# EAGLE design CurrentMonitor (EAGLE 6.4)

## Sheet 1 of 2
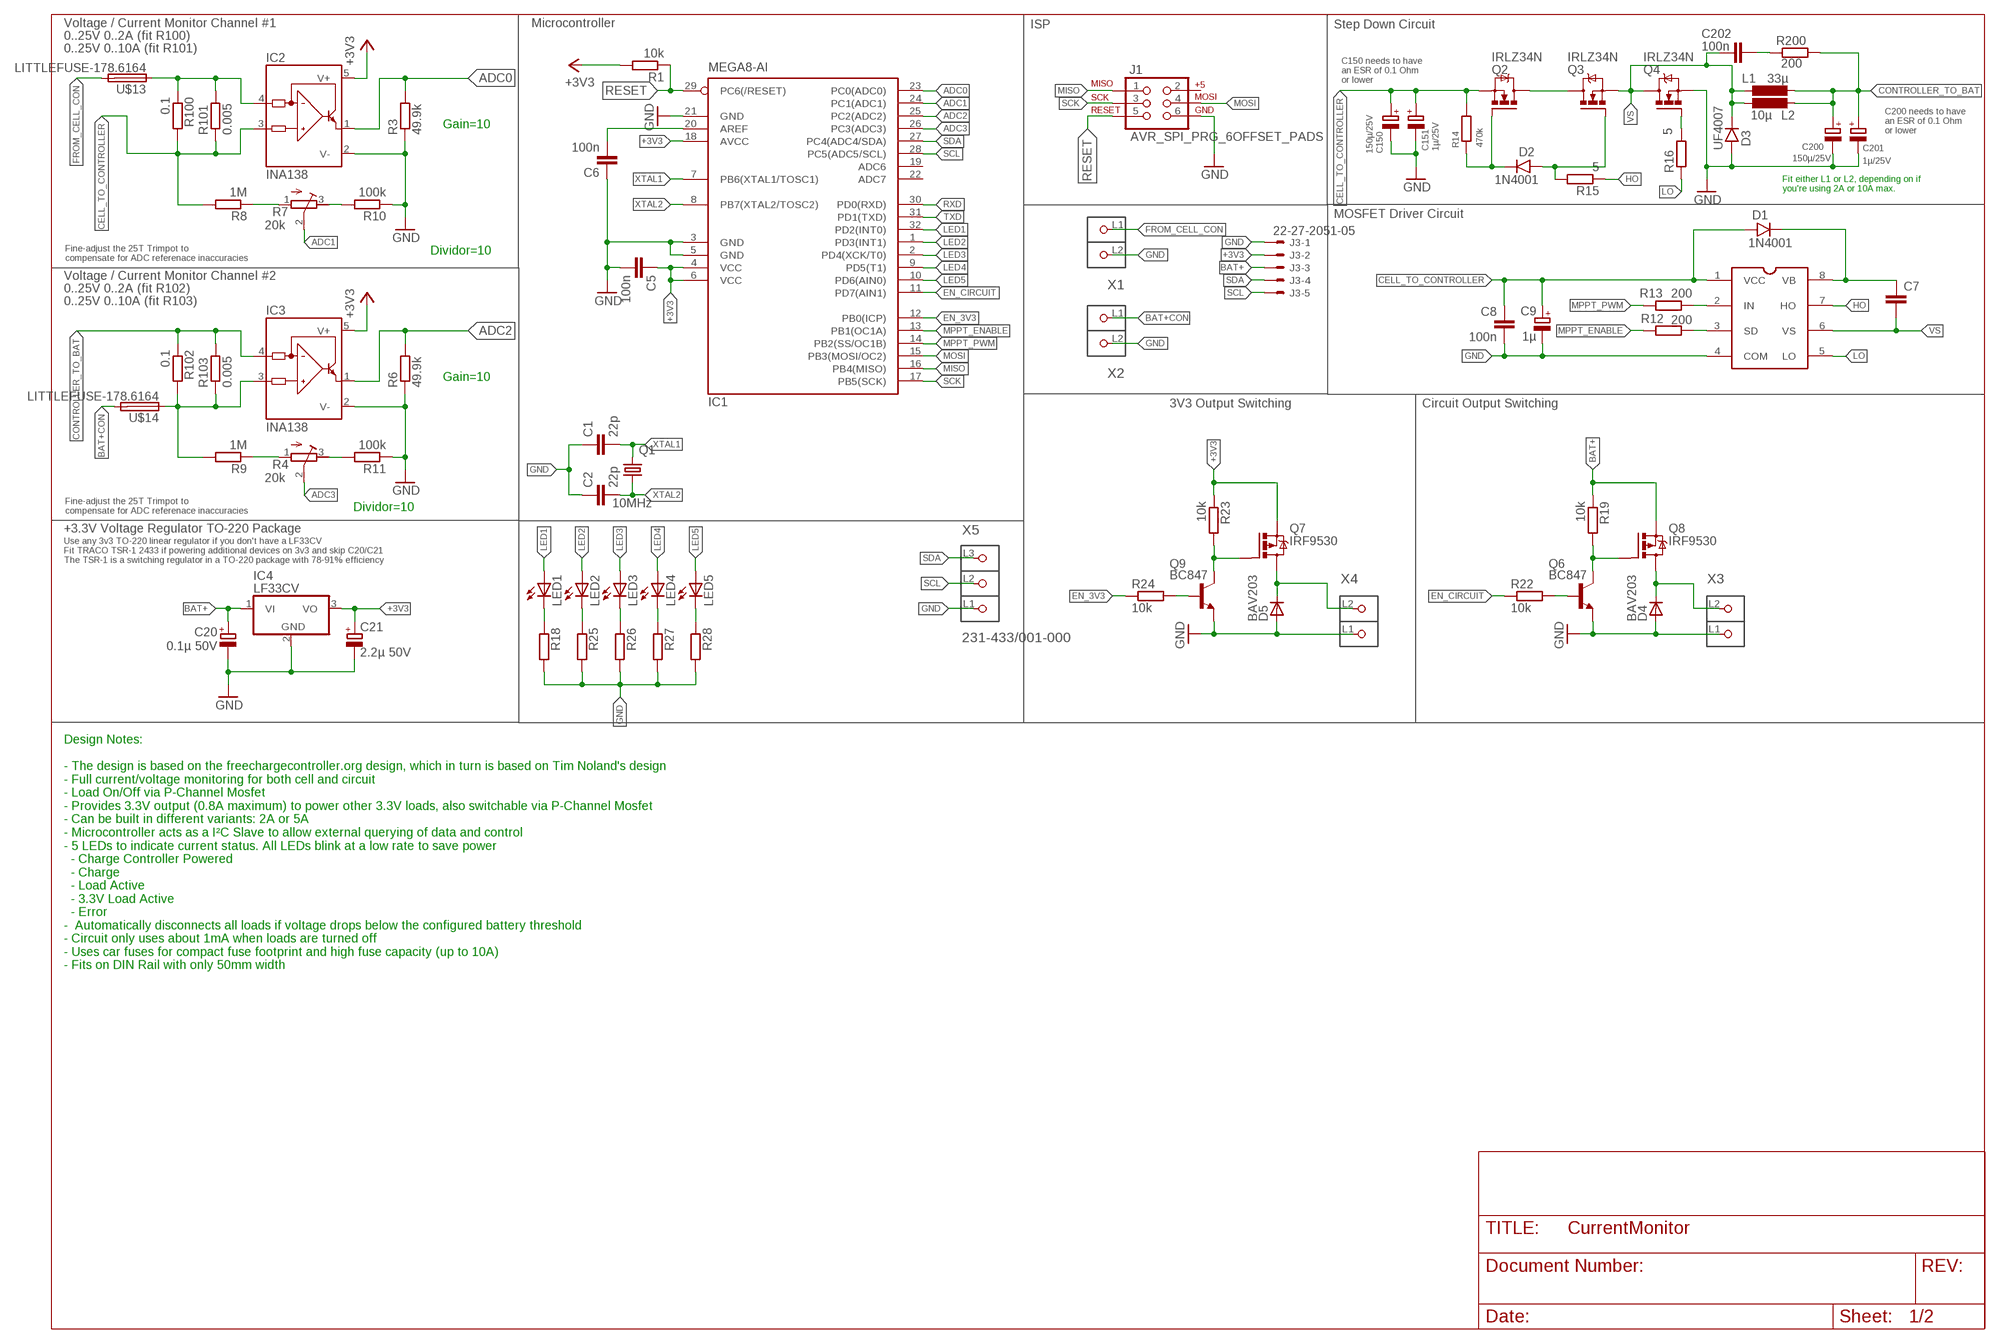
[diagram p0: schematic, sheet 1]

### Parts
C1  22p  C-EUC1206  [C1206]
C2  22p  C-EUC1206  [C1206]
C5  100n  C-EUC0805  [C0805]
C6  100n  C-EUC0805  [C0805]
C7  C-EUC0805  [C0805]
C8  100n  C-EUC0805  [C0805]
C9  1µ  CPOL-EUA  [PANASONIC_A]
C20  0.1µ 50V  CPOL-EUA  [PANASONIC_A]
C21  2.2µ 50V  CPOL-EUB  [PANASONIC_B]
C150  150µ/25V  CPOL-EUF  [PANASONIC_F]
C151  1µ/25V  CPOL-EUB  [PANASONIC_B]
C200  150µ/25V  CPOL-EUF  [PANASONIC_F]
C201  1µ/25V  CPOL-EUB  [PANASONIC_B]
C202  100n  C-EUC0805  [C0805]
D1  1N4001  DO41.3  [DO41-3]
D2  1N4001  DO41.3  [DO41-3]
D3  UF4007  DO41.3  [DO41-3]
D4  BAV203  D-SOD-80  [SOD80]
D5  BAV203  D-SOD-80  [SOD80]
IC1  MEGA8-AI  [TQFP32-08]
IC2  INA138  [SOT23-5]
IC3  INA138  [SOT23-5]
IC4  LF33CV  7805TV  [TO220V]
J1  AVR_SPI_PRG_6OFFSET_PADS  [2X3_OFFSET]
J3  22-27-2051-05  [6410-05]
L1  33µ  L-EUPISM  [PISM]
L2  10µ  L-EUPISR  [PISR]
LED1  LEDCHIPLED_1206  [CHIPLED_1206]
LED2  LEDCHIPLED_1206  [CHIPLED_1206]
LED3  LEDCHIPLED_1206  [CHIPLED_1206]
LED4  LEDCHIPLED_1206  [CHIPLED_1206]
LED5  LEDCHIPLED_1206  [CHIPLED_1206]
Q1  10MHz  CRYSTALCTS406  [CTS406]
Q2  IRLZ34N  IRF520  [TO220BV]
Q3  IRLZ34N  IRF520  [TO220BV]
Q4  IRLZ34N  IRF520  [TO220BV]
Q6  BC847  BC847ALT1SMD  [SOT23]
Q7  IRF9530  [TO220BV]
Q8  IRF9530  [TO220BV]
Q9  BC847  BC847ALT1SMD  [SOT23]
R1  10k  R-EU_R0805  [R0805]
R3  49.9k  R-EU_R0805  [R0805]
R4  20k  R-TRIMM64W  [RTRIM64W]
R6  49.9k  R-EU_R0805  [R0805]
R7  20k  R-TRIMM64W  [RTRIM64W]
R8  1M  R-EU_R0805  [R0805]
R9  1M  R-EU_R0805  [R0805]
R10  100k  R-EU_R0805  [R0805]
R11  100k  R-EU_R0805  [R0805]
R12  200  R-EU_R0805  [R0805]
R13  200  R-EU_R0805  [R0805]
R14  470k  R-EU_R0805  [R0805]
R15  5  R-EU_R0805  [R0805]
R16  5  R-EU_R0805  [R0805]
R18  R-EU_R0805  [R0805]
R19  10k  R-EU_R0805  [R0805]
R22  10k  R-EU_R0805  [R0805]
R23  10k  R-EU_R0805  [R0805]
R24  10k  R-EU_R0805  [R0805]
R25  R-EU_R0805  [R0805]
R26  R-EU_R0805  [R0805]
R27  R-EU_R0805  [R0805]
R28  R-EU_R0805  [R0805]
R100  0.1  R-EU_R1206  [R1206]
R101  0.005  R-EU_R2512  [R2512]
R102  0.1  R-EU_R1206  [R1206]
R103  0.005  R-EU_R2512  [R2512]
R200  200  R-EU_R0805  [R0805]
U$1  IR2104S  [IR2104S]
U$13  LITTLEFUSE-178.6164  [LITTLEFUSE-178-6164]
U$14  LITTLEFUSE-178.6164  [LITTLEFUSE-178-6164]
X1  231-432/001-000  [P-231-432/001-000]
X2  231-432/001-000  [P-231-432/001-000]
X3  231-432/001-000  [P-231-432/001-000]
X4  231-432/001-000  [P-231-432/001-000]
X5  231-433/001-000  [P-231-433/001-000]

### Nets
+3V3 [medpower]: C5.1 C21.+ IC1.4(VCC) IC1.6(VCC) IC1.18(AVCC) IC2.5(V+) IC3.5(V+) IC4.3(VO) J3.2 Q7.S R1.2 R23.1
ADC0: IC1.23(PC0(ADC0)) IC2.1(OUT) R3.2
ADC1: IC1.24(PC1(ADC1)) R7.2(S)
ADC2: IC1.25(PC2(ADC2)) IC3.1(OUT) R6.2
ADC3: IC1.26(PC3(ADC3)) R4.2(S)
BAT+ [highpower]: C20.+ IC3.3(IN+) IC4.1(VI) J3.3 Q8.S R9.2 R19.1 R102.2 R103.1 U$14.P$1
BAT+CON [highpower]: U$14.P$2 X2.L1(P1)
CELL_TO_CONTROLLER [highpower]: C8.1 C9.+ C150.+ C151.+ D1.A IC2.3(IN+) Q2.S R8.2 R14.2 R100.2 R101.1 U$1.1(VCC)
CONTROLLER_TO_BAT [highpower]: C200.+ C201.+ IC3.4(IN-) L1.2 L2.1 R102.1 R103.2 R200.2
EN_3V3: IC1.12(PB0(ICP)) R24.1
EN_CIRCUIT: IC1.11(PD7(AIN1)) R22.1
FROM_CELL [highpower]: IC2.4(IN-) R100.1 R101.2 U$13.P$1
FROM_CELL_CON [highpower]: U$13.P$2 X1.L1(P1)
GND: C1.1 C2.1 C5.2 C6.1 C8.2 C9.- C20.- C21.- C150.- C151.- C200.- C201.- D3.A D4.2(A) D5.2(A) IC1.3(GND) IC1.5(GND) IC1.21(GND) IC2.2(V-) IC3.2(V-) IC4.2(GND) J1.6 J3.1 Q4.S Q6.2(E) Q9.2(E) R3.1 R6.1 R10.1 R11.1 R18.2 R25.2 R26.2 R27.2 R28.2 U$1.4(COM) X1.L2(P2) X2.L2(P2) X3.L1(P1) X4.L1(P1) X5.L1(P1)
HO: R15.1 U$1.7(HO)
LED1: IC1.32(PD2(INT0)) LED1.A
LED2: IC1.1(PD3(INT1)) LED2.A
LED3: IC1.2(PD4(XCK/T0)) LED3.A
LED4: IC1.9(PD5(T1)) LED4.A
LED5: IC1.10(PD6(AIN0)) LED5.A
LO: R16.1 U$1.5(LO)
MISO: IC1.16(PB4(MISO)) J1.1
MOSI: IC1.15(PB3(MOSI/OC2)) J1.4
MPPT_ENABLE: IC1.13(PB1(OC1A)) R12.1
MPPT_PWM: IC1.14(PB2(SS/OC1B)) R13.1
N$1: C6.2 IC1.20(AREF)
N$2: R4.3(E) R11.2
N$3: R7.3(E) R10.2
N$4: R7.1(A) R8.1
N$5: R4.1(A) R9.1
N$6: LED1.C R18.1
N$8: R12.2 U$1.3(SD)
N$9: C7.1 D1.C U$1.8(VB)
N$10: R13.2 U$1.2(IN)
N$11: Q4.G R16.2
N$12: D2.C Q2.G R14.1
N$13: D2.A Q3.G R15.2
N$14 [highpower]: Q2.D Q3.D
N$16: D4.1(C) Q8.D X3.L2(P2)
N$17: C202.1 R200.1
N$18: LED2.C R25.1
N$20: Q6.3(C) Q8.G R19.2
N$21: Q6.1(B) R22.2
N$22 [medpower]: Q7.G Q9.3(C) R23.2
N$23: Q9.1(B) R24.2
N$25 [medpower]: D5.1(C) Q7.D X4.L2(P2)
N$26: LED3.C R26.1
N$29: LED4.C R27.1
N$32: LED5.C R28.1
RESET: IC1.29(PC6(/RESET)) J1.5 R1.1
RXD: IC1.30(PD0(RXD))
SCK: IC1.17(PB5(SCK)) J1.3
SCL: IC1.28(PC5(ADC5/SCL)) J3.5 X5.L2(P2)
SDA: IC1.27(PC4(ADC4/SDA)) J3.4 X5.L3(P3)
TXD: IC1.31(PD1(TXD))
VS [highpower]: C7.2 C202.2 D3.C L1.1 L2.2 Q3.S Q4.D U$1.6(VS)
XTAL1: C1.2 IC1.7(PB6(XTAL1/TOSC1)) Q1.3
XTAL2: C2.2 IC1.8(PB7(XTAL2/TOSC2)) Q1.1
Unconnected: IC1.19(ADC6) IC1.22(ADC7) J1.2

### Notes on the sheet
- Voltage / Current Monitor Channel #1 | Microcontroller | ISP | Step Down Circuit
- 0..25V 0..2A (fit R100)
- 0..25V 0..10A (fit R101)
- C150 needs to have
  an ESR of 0.1 Ohm
  or lower
- Gain=10
- C200 needs to have
  an ESR of 0.1 Ohm
  or lower
- Fit either L1 or L2, depending on if
  you're using 2A or 10A max.
- MOSFET Driver Circuit
- Dividor=10
- Fine-adjust the 25T Trimpot to
  compensate for ADC referenace inaccuracies
- Voltage / Current Monitor Channel #2
- 0..25V 0..2A (fit R102)
- 0..25V 0..10A (fit R103)
- Gain=10
- 3V3 Output Switching | Circuit Output Switching
- Dividor=10
- Fine-adjust the 25T Trimpot to
  compensate for ADC referenace inaccuracies
- +3.3V Voltage Regulator TO-220 Package
- Use any 3v3 TO-220 linear regulator if you don't have a LF33CV
  Fit TRACO TSR-1 2433 if powering additional devices on 3v3 and skip C20/C21
  The TSR-1 is a switching regulator in a TO-220 package with 78-91% efficiency
- Design Notes:
  
  - The design is based on the freechargecontroller.org design, which in turn is based on Tim Noland's design
  - Full current/voltage monitoring for both cell and circuit
  - Load On/Off via P-Channel Mosfet
  - Provides 3.3V output (0.8A maximum) to power other 3.3V loads, also switchable via P-Channel Mosfet
  - Can be built in different variants: 2A or 5A
  - Microcontroller acts as a I²C Slave to allow external querying of data and control
  - 5 LEDs to indicate current status. All LEDs blink at a low rate to save power
    - Charge Controller Powered
    - Charge
    - Load Active
    - 3.3V Load Active
    - Error
  -  Automatically disconnects all loads if voltage drops below the configured battery threshold
  - Circuit only uses about 1mA when loads are turned off
  - Uses car fuses for compact fuse footprint and high fuse capacity (up to 10A)
  - Fits on DIN Rail with only 50mm width

## Sheet 2 of 2
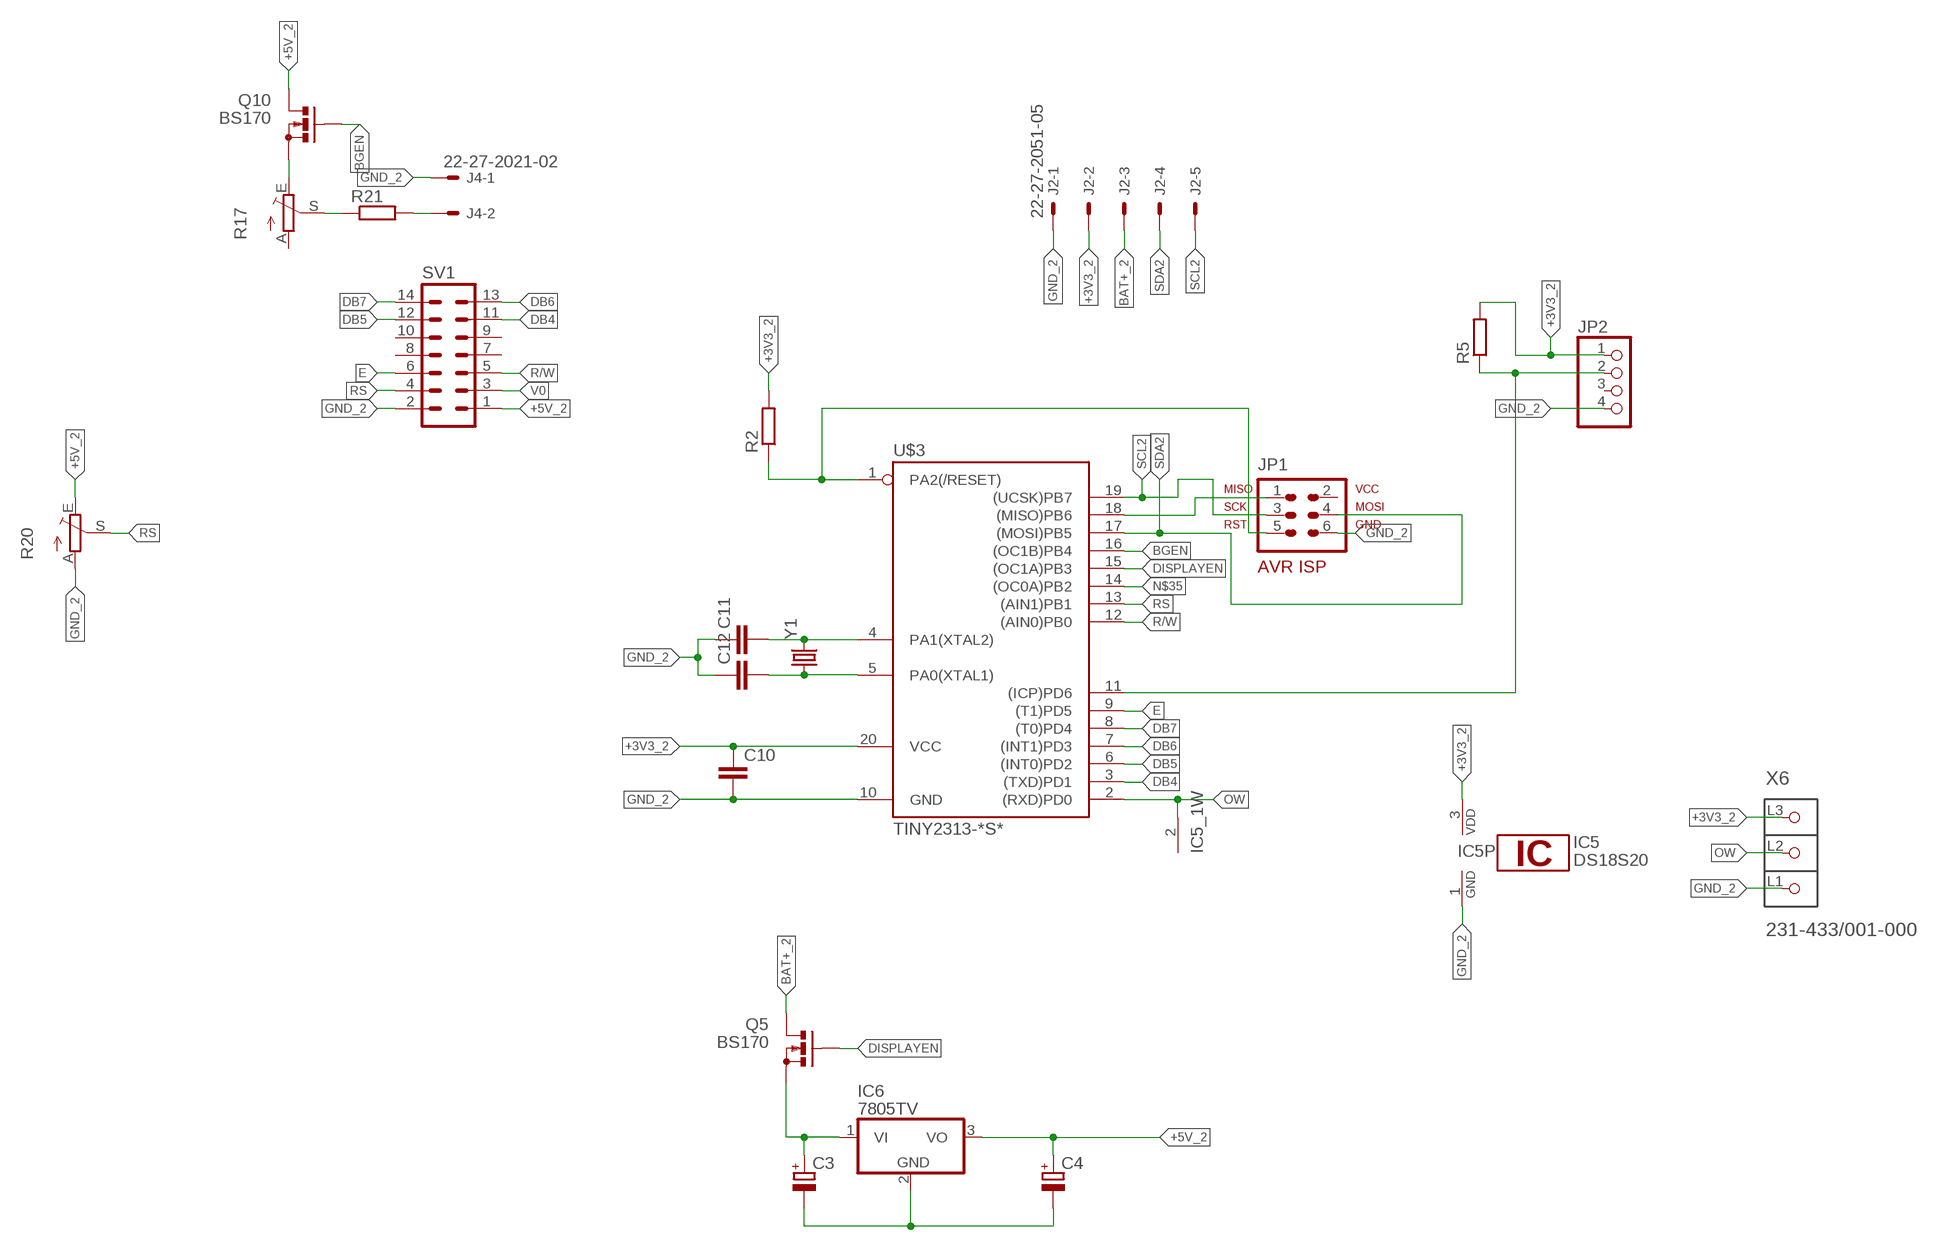
[diagram p1: schematic, sheet 2]

### Parts
C3  CPOL-EUE3.5-8  [E3,5-8]
C4  CPOL-EUE3.5-8  [E3,5-8]
C10  C-EUC0805  [C0805]
C11  C-EUC0805  [C0805]
C12  C-EUC0805  [C0805]
IC5  DS18S20  [TO92-]
IC6  7805TV  [TO220V]
J2  22-27-2051-05  [6410-05]
J4  22-27-2021-02  [6410-02]
JP1  AVR-ISP-6VERT  [AVR-ISP-6]
JP2  PINHD-1X4  [1X04]
Q5  BS170  [SOT54E]
Q10  BS170  [SOT54E]
R2  R-EU_R0805  [R0805]
R5  R-EU_R0805  [R0805]
R17  TRIM_EU-PT10  [PT-10]
R20  TRIM_EU-PT10  [PT-10]
R21  R-EU_R0805  [R0805]
SV1  ML14  [ML14]
U$3  TINY2313-*S*  [SO20L$]
X6  231-433/001-000  [P-231-433/001-000]
Y1  CRYSTALHC49US  [HC49US]

### Nets
+3V3_2: C10.1 IC5.3 J2.2 JP2.1 R2.2 R5.2 U$3.20(VCC) X6.L3(P3)
+5V_2: C4.+ IC6.3(VO) Q10.D R20.E SV1.1
BAT+_2: J2.3 Q5.D
BGEN: Q10.G U$3.16((OC1B)PB4)
DB4: SV1.11 U$3.3((TXD)PD1)
DB5: SV1.12 U$3.6((INT0)PD2)
DB6: SV1.13 U$3.7((INT1)PD3)
DB7: SV1.14 U$3.8((T0)PD4)
DISPLAYEN: Q5.G U$3.15((OC1A)PB3)
E: SV1.6 U$3.9((T1)PD5)
GND_2: C3.- C4.- C10.2 C11.1 C12.1 IC5.1 IC6.2(GND) J2.1 J4.1 JP1.6 JP2.4 R20.A SV1.2 U$3.10(GND) X6.L1(P1)
N$7: JP1.1 U$3.18((MISO)PB6)
N$15: R17.S R21.1
N$19: JP2.2 R5.1 U$3.11((ICP)PD6)
N$24: J4.2 R21.2
N$27: JP1.5 R2.1 U$3.1(PA2(/RESET))
N$28: Q10.S R17.E
N$30: C11.2 U$3.4(PA1(XTAL2)) Y1.2
N$31: C12.2 U$3.5(PA0(XTAL1)) Y1.1
N$33: C3.+ IC6.1(VI) Q5.S
N$35: U$3.14((OC0A)PB2)
OW: IC5.2 U$3.2((RXD)PD0) X6.L2(P2)
R/W: SV1.5 U$3.12((AIN0)PB0)
RS: R20.S SV1.4 U$3.13((AIN1)PB1)
SCL2: J2.5 JP1.3 U$3.19((UCSK)PB7)
SDA2: J2.4 JP1.4 U$3.17((MOSI)PB5)
V0: SV1.3
Unconnected: JP1.2 JP2.3 R17.A SV1.7 SV1.8 SV1.9 SV1.10

## Library data of the parts
C1 C2 C10 = rcl:C-EU: CAPACITOR, European symbol
C3 C4 C9 C20 C21 C150 C151 C201 = rcl:CPOL-EU: POLARIZED CAPACITOR, European symbol
C5-C8 C11 C12 C202 = resistor:C-EU: CAPACITOR, European symbol
C200 = rcl:CPOL-EU: POLARIZED CAPACITOR, European symbol; OC_REICHELT: VF 150/25 P-F
D1-D3 = gm-diodes:DO41: DO-41 Package Diodes: 1N4001 - 1N40019 Zener Diodes: 1N4728 - 1N4764
D4 D5 = semicon-smd-ipc:D-: DIODE unfilled
IC1 = atmel:MEGA8: MICROCONTROLLER 8 Kbytes FLASH, 1 kbytes SRAM, 512 bytes EEPROM, USART, 6-channel 10 bit ADC, 2-channel 8 bit ADC Pin compatible with Atmega48, ATMega88, ATMega168 Source: avr.lbr; MPN: ATMEGA8-16AU; OC_FARNELL: 9171371; OC_NEWARK: 73M8863
IC2 IC3 = burr-brown:INA138: High-Side Measurement Current Shunt Monitor; MF: TEXAS INSTRUMENTS; MPN: INA138NA/250; OC_FARNELL: 1564888; OC_NEWARK: 80K5906
IC4 IC6 = linear:78*: Positive VOLTAGE REGULATOR Source: http://cache.national.com/ds/LM/LM78L05.pdf http://www.fairchildsemi.com/ds/LM/LM7805.pdf
IC5 = 1wire:DS18S20: High Precision Digital Thermometer This chip provides a onewire thermosensor with approx. 0.5°C accuracy.A programmable over/undertemperure alarm is available. Notes: Vdd must be applied for accurate measurements at low temperatures, as the parasite power circuit otherwise heats the sensor. If parasite power is used, Vdd has to be connected to GND. The DS1822 is a low-cost thermometer chip, the DS18B20 is similar to the DS18S20, but with 9..12 Bit programmable precision. Author: Jan Kandziora <jjj@gmx.de>
J1 = SparkFun:AVR_SPI_PRG_6: AVR ISP 6 Pin This is the reduced ISP connector for AVR programming. Common on Arduino. This footprint will take up less PCB space and can be used with a 10-pin to 6-pin adapter such as SKU: BOB-08508
J2 J3 = con-molex:22-?-05: CONNECTOR wire to board 2.54 mm (.1 inch) pitch header; OC_FARNELL: unknown; OC_NEWARK: unknown
J4 = con-molex:22-?-02: CONNECTOR wire to board 2.54 mm (.1 inch) pitch header; OC_FARNELL: unknown; OC_NEWARK: unknown
JP1 = avr-7:AVR-ISP-6: AVR ISP-6 Serial Programming Header
JP2 = pinhead:PINHD-1X4: PIN HEADER
L1 L2 = Inductor-Fastron:L-EU
LED1-LED5 = led:LED: LED OSRAM: - CHIPLED LG R971, LG N971, LY N971, LG Q971, LY Q971, LO R971, LY R971 LH N974, LH R974 LS Q976, LO Q976, LY Q976 LO Q996 - Hyper CHIPLED LW Q18S LB Q993, LB Q99A, LB R99A - SideLED LS A670, LO A670, LY A670, LG A670, LP A670 LB A673, LV A673, LT A673, LW A673 LH A674 LY A675 LS A676, LA A676, LO A676, LY A676, LW A676 LS A679, LY A679, LG A679 - Hyper Micro SIDELED® LS Y876, LA Y876, LO Y876, LY Y876 LT Y87S - SmartLED LW L88C, LW L88S LB L89C, LB L89S, LG L890 LS L89K, LO L89K, LY L89K LS L896, LA L896, LO L896, LY L896 - TOPLED LS T670, LO T670, LY T670, LG T670, LP T670 LSG T670, LSP T670, LSY T670, LOP T670, LYG T670 LG T671, LOG T671, LSG T671 LB T673, LV T673, LT T673, LW T673 LH T674 LS T676, LA T676, LO T676, LY T676, LB T676, LH T676, LSB T676, LW T676 LB T67C, LV T67C, LT T67C, LS T67K, LO T67K, LY T67K, LW E67C LS E67B, LA E67B, LO E67B, LY E67B, LB E67C, LV E67C, LT E67C LW T67C LS T679, LY T679, LG T679 LS T770, LO T770, LY T770, LG T770, LP T770 LB T773, LV T773, LT T773, LW T773 LH T774 LS E675, LA E675, LY E675, LS T675 LS T776, LA T776, LO T776, LY T776, LB T776 LHGB T686 LT T68C, LB T68C - Hyper Mini TOPLED® LB M676 - Mini TOPLED Santana® LG M470 LS M47K, LO M47K, LY M47K Source: http://www.osram.convergy.de LUXEON: - LUMILED® LXK2-PW12-R00, LXK2-PW12-S00, LXK2-PW14-U00, LXK2-PW14-V00 LXK2-PM12-R00, LXK2-PM12-S00, LXK2-PM14-U00 LXK2-PE12-Q00, LXK2-PE12-R00, LXK2-PE12-S00, LXK2-PE14-T00, LXK2-PE14-U00 LXK2-PB12-K00, LXK2-PB12-L00, LXK2-PB12-M00, LXK2-PB14-N00, LXK2-PB14-P00, LXK2-PB14-Q00 LXK2-PR12-L00, LXK2-PR12-M00, LXK2-PR14-Q00, LXK2-PR14-R00 LXK2-PD12-Q00, LXK2-PD12-R00, LXK2-PD12-S00 LXK2-PH12-R00, LXK2-PH12-S00 LXK2-PL12-P00, LXK2-PL12-Q00, LXK2-PL12-R00 Source: www.luxeon.com KINGBRIGHT: KA-3528ASYC Source: www.kingbright.com
Q1 = crystal:CRYSTAL: CRYSTAL; OC_FARNELL: unknown; OC_NEWARK: unknown
Q2-Q4 = transistor-power:IRF520: HEXFET Power MOSFET
Q5 Q10 = transistor-small-signal:BS170: N-CHANNEL MOS FET
Q6 Q9 = transistor-npn:BC847*: NPN Transistor
Q7 Q8 = transistor-power:IRF9530: P-CHANNEL HEXFET POWER-MOS-FET Source: http://www.irf.com/product-info/datasheets/data/irf9530.pdf
R1-R3 R6 R8-R14 R18 R19 R21 R23 R25-R28 R200 = rcl:R-EU_: RESISTOR, European symbol
R4 R7 = rcl:R-TRIMM: Trimm resistor
R5 R15 R16 R22 R24 R100-R103 = resistor:R-EU_: RESISTOR, European symbol
R17 R20 = pot:TRIM_EU-: POTENTIOMETER
SV1 = con-ml:ML14: HARTING; OC_FARNELL: unknown; OC_NEWARK: unknown
U$1 = ir-2104:IR2104S: Half Bridge Mosfet - IGBT driver SOIC
U$3 = avr-7:TINY2313*: Atmel Tiny2313 2K Flash, 128 bytes EEPROM, 128 bytes RAM
U$13 U$14 = PudenzCarFuseFLR:LITTLEFUSE-178.6164
X1-X4 = con-wago_5.0mm:231-432/001-000: Serie 231, Stiftleiste mit abgewinkelten Einlötstiften / Series 231, Male connector with angled solder pins Polzahl / Pole No.: 2 Rastermaß / Pitch: 5 mm Bemessungsspannung / Rated Voltage: 320 V Nennstrom / Nominal Current: 16 A Lötstiftlänge: / Solder Pin Length: 3.8 mm Farbe / Color: grau / gray Stand: 01.01.2012. Die jeweils aktuellen Daten zu diesem Artikel finden Sie in unserem Produktkatalog, den Sie unter www.wago.com einsehen können. As of: 01/01/2012. Please find the newest data for this article in our product catalogue, which can be viewed under www.wago.com.
X5 X6 = con-wago_5.0mm:231-433/001-000: Serie 231, Stiftleiste mit abgewinkelten Einlötstiften / Series 231, Male connector with angled solder pins Polzahl / Pole No.: 3 Rastermaß / Pitch: 5 mm Bemessungsspannung / Rated Voltage: 320 V Nennstrom / Nominal Current: 16 A Lötstiftlänge: / Solder Pin Length: 3.8 mm Farbe / Color: grau / gray Stand: 01.01.2012. Die jeweils aktuellen Daten zu diesem Artikel finden Sie in unserem Produktkatalog, den Sie unter www.wago.com einsehen können. As of: 01/01/2012. Please find the newest data for this article in our product catalogue, which can be viewed under www.wago.com.
Y1 = SparkFun:CRYSTAL: Crystals Various standard crystals. Proven footprints. Spark Fun Electronics SKU : COM-00534

## Net classes
1 highpower: width 0.305 mm
2 medpower: width 0.305 mm

## Board
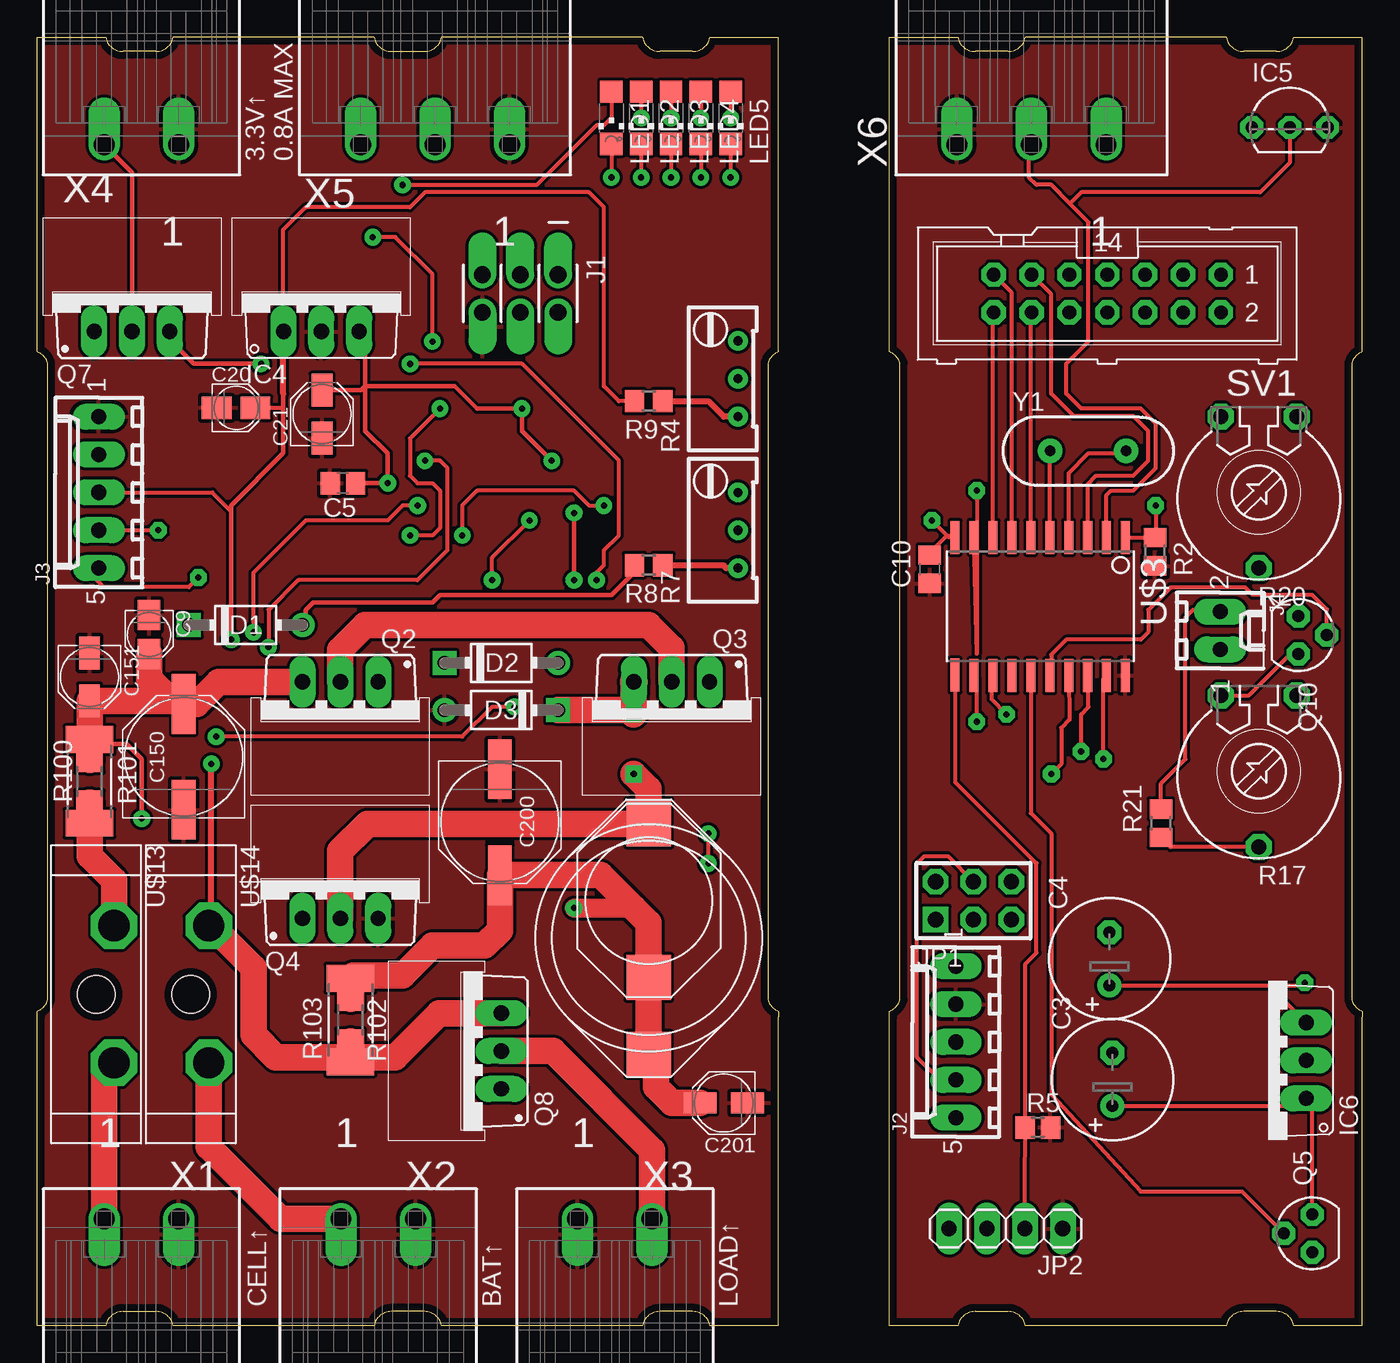
[diagram p2: board, top side]
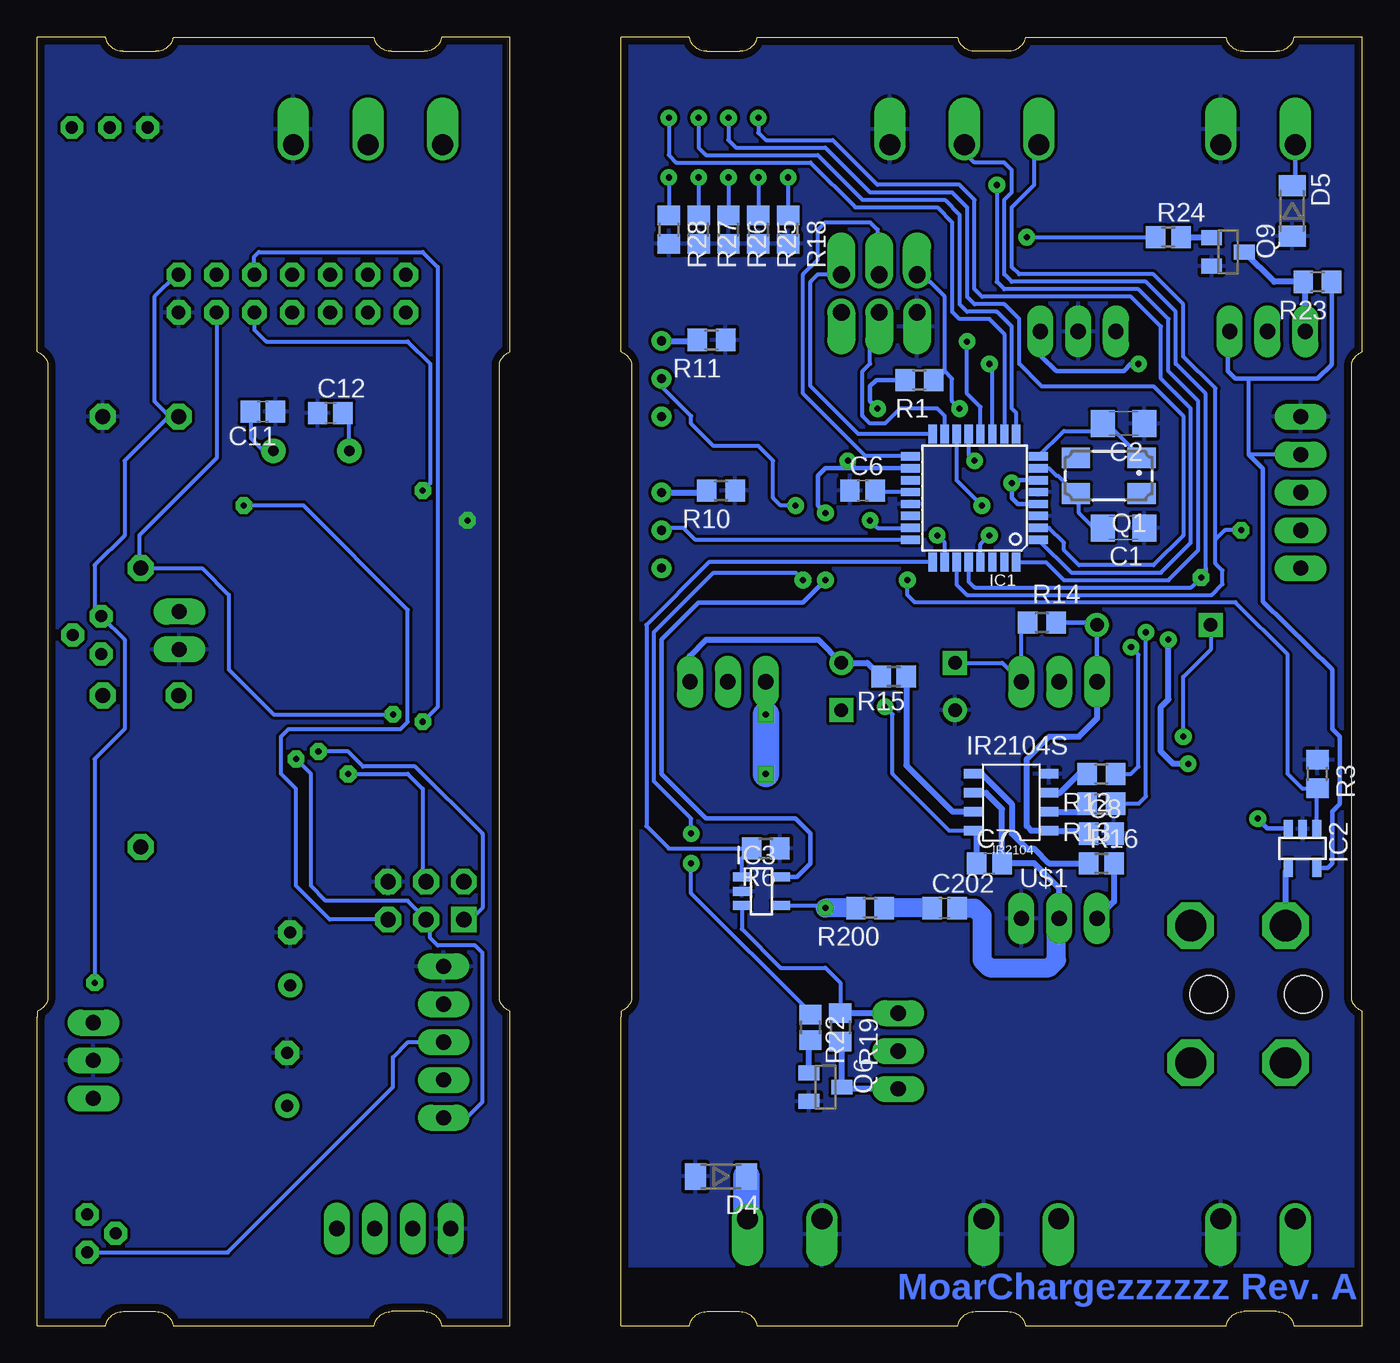
[diagram p3: board, bottom side, seen from below]

Size 88.85 x 86.4 mm. Coordinates in mm from the lower left corner, seen from the top.
Copper layers (1*16): Top 0.035mm / dielectric 1.5mm / Bottom 0.035mm
Design rules "default *": minimum track width 10mil, minimum drill 16mil, track to track 8mil, track to pad 8mil, pad to pad 8mil, via to via 8mil, smd to smd 8mil, copper to edge 0.5mm, drill to drill 8mil, minimum pad ring 14mil, minimum via ring 14mil, stop-mask expansion 4mil, vias tented up to drill 0mil, thermal gap 10mil

### Footprints (pad centres in the part's own frame; a part is rotated, then mirrored left to right if it is on the bottom)
C1206 = smd 1.6 x 1.8: 1 -1.4,0; 2 1.4,0
E3,5-8 = drill 0.813 pad 1.6: + -1.778,0 | drill 0.813 pad 1.6 octagon: - 1.778,0
C0805 = smd 1.3 x 1.5: 1 -0.85,0; 2 0.85,0
PANASONIC_A = smd 2 x 1.5: + 1.3,0; - -1.3,0
C0805' = smd 1.3 x 1.5: 1 -0.95,0; 2 0.95,0
PANASONIC_B = smd 2.2 x 1.4: + 1.6,0; - -1.6,0
PANASONIC_F = smd 4 x 1.6: + 3.55,0; - -3.55,0
DO41-3 = drill 0.9: A 3.81,0 | drill 0.9 square: C -3.81,0
SOD80 = smd 1.4 x 1.8: 1 -1.7,0; 2 1.7,0
TQFP32-08 = smd 1.27 x 0.559: 1 -4.293,2.8; 2 -4.293,2; 3 -4.293,1.2; 4 -4.293,0.4; 5 -4.293,-0.4; 6 -4.293,-1.2; 7 -4.293,-2; 8 -4.293,-2.8; 17 4.293,-2.8; 18 4.293,-2; 19 4.293,-1.2; 20 4.293,-0.4; 21 4.293,0.4; 22 4.293,1.2; 23 4.293,2; 24 4.293,2.8 | smd 0.559 x 1.27: 9 -2.8,-4.293; 10 -2,-4.293; 11 -1.2,-4.293; 12 -0.4,-4.293; 13 0.4,-4.293; 14 1.2,-4.293; 15 2,-4.293; 16 2.8,-4.293; 25 2.8,4.293; 26 2,4.293; 27 1.2,4.293; 28 0.4,4.293; 29 -0.4,4.293; 30 -1.2,4.293; 31 -2,4.293; 32 -2.8,4.293
SOT23-5 = smd 0.6 x 1.2: 1 -0.95,-1.306; 2 0,-1.306; 3 0.95,-1.306; 4 0.95,1.306; 5 -0.95,1.306
TO220V = drill 1.016 long: 1 -2.54,-2.54; 2 0,-2.54; 3 2.54,-2.54
TO92- = drill 0.813 octagon: 1 -2.54,0; 2 0,0; 3 2.54,0
2X3_OFFSET = drill 1.118 pad 1.88 offset: 1 -2.54,-1.27; 2 -2.54,1.27; 3 0,-1.27; 4 0,1.27; 5 2.54,-1.27; 6 2.54,1.27
6410-05 = drill 1.016 long: 1 5.08,0; 2 2.54,0; 3 0,0; 4 -2.54,0; 5 -5.08,0
6410-02 = drill 1.016 long: 1 1.27,0; 2 -1.27,0
AVR-ISP-6 = drill 1.016 square: 1 -2.54,-1.27 | drill 1.016 octagon: 2 -2.54,1.27; 3 0,-1.27; 4 0,1.27; 5 2.54,-1.27; 6 2.54,1.27
1X04 = drill 1.016 long: 1 -3.81,0; 2 -1.27,0; 3 1.27,0; 4 3.81,0
PISM = smd 3 x 3: 1 -5.15,0; 2 5.15,0
PISR = smd 3 x 3: 1 -7.8,0; 2 7.8,0
CHIPLED_1206 = smd 1.5 x 1.5: A 0,-1.75; C 0,1.75
CTS406 = smd 1.9 x 1.4: 1 -2.2,-1.2; 2 2.2,-1.2; 3 2.2,1.2; 4 -2.2,1.2
TO220BV = drill 1.016 long: D 0,-2.54; G -2.54,-2.54; S 2.54,-2.54
SOT54E = drill 0.813 octagon: D -1.27,0; G 0,1.905; S 1.27,0
SOT23 = smd 1 x 1.4: 1 -0.95,-1.1; 2 0.95,-1.1; 3 0,1.1
R0805 = smd 1.3 x 1.5: 1 -0.95,0; 2 0.95,0
RTRIM64W = drill 0.61: 1 1.27,-2.54; 2 1.27,0; 3 1.27,2.54
R0805' = smd 1.3 x 1.5: 1 -0.85,0; 2 0.85,0
PT-10 = drill 1.016 octagon: A -2.54,-5.08; E 2.54,-5.08; S 0,5.08
R1206 = smd 1.6 x 1.803: 1 -1.422,0; 2 1.422,0
R2512 = smd 1.8 x 3.2: 1 -2.8,0; 2 2.8,0
ML14 = drill 0.914 octagon: 1 -7.62,-1.27; 2 -7.62,1.27; 3 -5.08,-1.27; 4 -5.08,1.27; 5 -2.54,-1.27; 6 -2.54,1.27; 7 0,-1.27; 8 0,1.27; 9 2.54,-1.27; 10 2.54,1.27; 11 5.08,-1.27; 12 5.08,1.27; 13 7.62,-1.27; 14 7.62,1.27
IR2104S = smd 1.27 x 0.635: 1 0,3.81; 2 0,2.54; 3 0,1.27; 4 0,0; 5 5.08,0; 6 5.08,1.27; 7 5.08,2.54; 8 5.08,3.81
SO20L$ = smd 0.61 x 2.21: 1 -5.715,-4.636; 2 -4.445,-4.636; 3 -3.175,-4.636; 4 -1.905,-4.636; 5 -0.635,-4.636; 6 0.635,-4.636; 7 1.905,-4.636; 8 3.175,-4.636; 9 4.445,-4.636; 10 5.715,-4.636; 11 5.715,4.61; 12 4.445,4.636; 13 3.175,4.636; 14 1.905,4.636; 15 0.635,4.636; 16 -0.635,4.636; 17 -1.905,4.636; 18 -3.175,4.636; 19 -4.445,4.636; 20 -5.715,4.636
LITTLEFUSE-178-6164 = drill 2.1 octagon: P$1 -4.6,1.2; P$2 4.6,1.2 | hole 2.5: 0,0
P-231-432/001-000 = drill 1.4 offset: L1 -4,-2.5; L2 -4,2.5
P-231-433/001-000 = drill 1.4 offset: L1 -4,-5; L2 -4,0; L3 -4,5
HC49US = drill 0.7 pad 1.651: 1 -2.54,0; 2 2.54,0

### Placement (x,y rotation side)
C1  16,53.5 180 bottom
C2  16,60.5 180 bottom
C3  72.11,16.51 90 top
C4  71.9,24.6 90 top
C5  20.5,56.5 180 top
C6  33.5,56 0 bottom
C7  25,31 0 bottom
C8  17.5,33 0 bottom
C9  7.5,46.34 270 top
C10  [C0805']  59.85,50.73 90 top
C11  73.72,61.3 180 bottom
C12  69.2,61.2 0 bottom
C20  13.33,61.55 0 top
C21  19.1,61.13 90 top
C150  9.82,38.15 90 top
C151  3.5,43.5 270 top
C200  31.02,33.77 270 top
C201  46.03,14.94 180 top
C202  28,28 0 bottom
D1  13.97,46.99 0 top
D2  31.12,44.45 0 top
D3  31.12,41.27 180 top
D4  43,10 180 bottom
D5  4.69,74.76 270 bottom
IC1  26,55.5 180 bottom
IC2  4,32 180 bottom
IC3  40.29,29.14 270 bottom
IC4  19.05,69.22 0 top
IC5  83.99,80.35 0 top
IC6  82.55,17.78 90 top
J1  32.39,69.22 180 top
J2  61.6,19.02 90 top
J3  4.13,55.88 90 top
J4  79.33,46.62 270 top
JP1  62.78,28.5 0 top
JP2  64.95,6.51 180 top
L1  41,28.5 270 top
L2  41,26 90 top
LED1  38.5,81 180 top
LED2  40.5,81 180 top
LED3  42.5,81 180 top
LED4  44.5,81 180 top
LED5  46.5,81 180 top
Q1  17,57 180 bottom
Q2  20.32,40.64 180 top
Q3  42.55,40.64 180 top
Q4  20.32,29.84 0 top
Q5  85.5,6.19 90 top
Q6  36,16 270 bottom
Q7  6.35,69.22 0 top
Q8  28.58,18.41 90 top
Q9  9,72 270 bottom
Q10  84.57,46.31 270 top
R1  29.7,63.41 180 bottom
R2  74.95,51.9 270 top
R3  3,37 270 bottom
R4  45.72,63.5 0 top
R5  [R0805']  67.1,13.29 0 top
R6  40,32 180 bottom
R7  45.72,53.34 0 top
R8  41,51 180 top
R9  41,62 180 top
R10  43,56 180 bottom
R11  43.64,66.1 180 bottom
R12  17.5,37 180 bottom
R13  17.5,35 180 bottom
R14  21.48,47.15 0 bottom
R15  5  [R0805']  31.42,43.53 180 bottom
R16  5  [R0805']  17.5,31 0 bottom
R17  81.92,37.18 180 top
R18  38.5,73.5 270 bottom
R19  35,20 270 bottom
R20  81.92,55.88 180 top
R21  75.35,33.69 90 top
R22  10k  [R0805']  37,20 270 bottom
R23  3,70 180 bottom
R24  10k  [R0805']  13,73 0 bottom
R25  40.5,73.5 270 bottom
R26  42.5,73.5 270 bottom
R27  44.5,73.5 270 bottom
R28  46.5,73.5 270 bottom
R100  3.5,36.5 90 top
R101  3.5,36.5 270 top
R102  21,20.5 270 top
R103  21,20.5 90 top
R200  33,28 180 bottom
SV1  71.76,69.22 180 top
U$1  21,37 180 bottom
U$2  [BC35,6]  57.15,0 0 top
U$3  67.26,48.23 180 top
U$6  [PR5/15-M3]  19.05,71.75 0 top
U$7  [BC53,6]  0,0 0 top
U$8  [PR5/15-M3]  20.32,32.38 0 top
U$9  [PR5/15-M3]  26.04,18.41 90 top
U$10  [PR5/15-M3]  6.35,71.75 0 top
U$11  [PR5/15-M3]  42.55,38.1 180 top
U$12  [PR5/15-M3]  20.32,38.1 180 top
U$13  3.95,22.23 270 top
U$14  10.3,22.23 270 top
X1  6.99,3.17 270 top
X2  22.86,3.17 270 top
X3  38.74,3.17 270 top
X4  6.99,83.19 90 top
X5  26.67,83.19 90 top
X6  66.68,83.19 90 top
Y1  70.47,58.66 0 top

### Tracks (layer width: path | path; a pad name or v marks a point on that pad's centre or on a via)
+3V3  (via drill 0.41)
  Top 0.254: 29.5,61.5 28,63
  Top 0.305: v23.5,56.5 23.5,57 | 23.5,57 23.5,58.5 22,60 22,63 | 22,63 22,66.27 IC4.3 | C21.+ 21.73,62.73 22,63 | C5.1 23,56.5 23.5,57 | v34.5,58 32.5,60 v32.5,61.5 29.5,61.5 | Q7.S 8.89,66.11 10.5,64.5 v15,64.5 | v36,50 v36,54.5 | 28,63 22,63
  Bottom 0.254: J3.2 7.62,58.42 7.62,63.38 7.5,63.5
  Bottom 0.305: IC1.4 23.1,55.1 23.5,55.5 v23.5,56.5 23.3,56.7 IC1.6 | R1.2 32.59,63.41 33,63 33,62 v32.5,61.5 | v34.5,58 34,57.5 | 34,57.5 IC1.18 | IC2.5 2.31,30.69 2,31 2,34.5 1.5,35 1.5,39.5 2,40 2,44 6.67,48.58 6.67,57.47 7.62,58.42 | Q7.S 9,66.56 9,64 8.5,63.5 7.5,63.5 3,63.5 2.05,64.45 R23.1 | v15,64.5 15.5,64.5 16,64 20.5,64 21.5,65 21.5,66.58 IC4.3 | IC3.5 37.92,30.09 37,31 37,33 38,34 44,34 47,37 47,46 44.5,48.5 37.5,48.5 v36,50 | v36,54.5 36.5,55 36.5,57 36,57.5 34,57.5
+3V3_2
  pour Top: 57,0 89,0 89,86 57,86
+5V_2  (via drill 0.41 pad 0.3)
  Top 0.254: C4.+ 82.59,22.82 | 82.59,22.82 IC6.3 | 82.59,22.82 84.82,22.82 v85,23
  Bottom 0.254: SV1.1 79.52,70.48 81,69 81,62 80,61 79.42,61 R20.E 80.04,60.96 83,58 83,53 85,51 85,48.01 Q10.D 83,46 83,40 85,38 v85,23
ADC0  (via drill 0.41)
  Top 0.254: v30.5,50 30.5,51.5 v33,54
  Bottom 0.254: IC2.1 3.05,36 | 3.05,36 R3.2 | 3.05,36 4,36 5,37 5,45 8.5,48.5 30,48.5 30.5,49 v30.5,50 | v33,54 32.5,53.5 IC1.23
ADC1
  Bottom 0.254: IC1.24 44.7,52.7 45.5,53.5 46.83,53.5 R7.2
ADC2
  Bottom 0.254: IC3.1 41.6,31.35 R6.2 46.5,32 48,33.5 48,47 43.79,51.21 IC1.25
ADC3  (via drill 0.41)
  Top 0.254: v38,55 37,55 36,56 29.5,56 28.5,55 v28.5,53
  Bottom 0.254: R4.2 46.99,62.99 45,61 45,60.5 43.5,59 40.5,59 39.5,58 39.5,55.5 39,55 v38,55 | IC1.26 28,52.5 v28.5,53
BAT+  (via drill 0.41)
  Top 0.254: IC4.1 16.5,66.69 16.5,73.5 18,75 25,75 26,76 37,76 38,75 38,63 39,62 R9.2 | J3.3 11.73,55.88 13,54.61 | C20.+ 16.5,61.55 16.5,62.23
  Top 0.305: 16.5,62.5 16.5,62.23 16.5,58.5 13,55 13,54.61 v13,46
  Top 0.406: 11.68,26.82 v11.68,37.67 | 16.5,62.5 IC4.1
  Top 1.778: R103.1 R102.2 | Q8.S 26.96,20.95 24,18 21.3,18 R103.1 | U$14.P$1 11.68,26.82 14.5,24 14.5,19.5 16,18 20.7,18 R103.1
  Bottom 0.254: IC3.3 41.6,26.6 39,24 36,24 35,23 R19.1
  Bottom 0.406: Q8.S R19.1 | v11.68,37.67 12.68,37.67 13.5,38.5 13.5,41.5 13,42 v13,46
BAT+_2
  Bottom 0.254: Q5.D 76.08,4.92 65,16 65,18 63.98,19.02 J2.3
BAT+CON
  Top 1.778: X2.L1 16.33,7.17 11.5,12 U$14.P$2
BGEN
  Top 0.254: Q10.G 86.48,48.02 85.5,49 81.5,49 81,49.5 76,49.5 74.5,48 74.5,46.5 74,46 69,46 68,45 68,43.7 U$3.16
CELL_TO_CONTROLLER  (via drill 0.41)
  Top 0.305: R8.2 40.05,50.55 38.5,49 27,49 26.5,48.5 18.5,48.5 18,48 18,47.21 D1.A | v7,34 7,38 6,39 3.8,39 R101.1
  Top 1.778: R100.2 R101.1 C151.+ 9,41.9 | 9,41.9 9.62,41.9 | C150.+ 10.7,41.7 12.18,43.18 Q2.S | C9.+ 7.5,43.4 9,41.9
  Top 1.829: 9.62,41.9 C150.+
  Bottom 0.254: 17.94,47.15 D1.A
  Bottom 0.305: 17.94,47.15 R14.2 20.53,47.53 | D1.A Q2.S | IC2.3 5,33.36 6.36,33.36 v7,34
  Bottom 0.406: C8.1 18.54,33.19 U$1.1 22.19,33.19 22.5,33.5 22.5,38 21,39.5 19,39.5 17.78,40.72 Q2.S
CONTROLLER_TO_BAT  (via drill 0.41)
  Top 1.27: v36,28 40,28
  Top 1.778: L2.1 L1.2 41,27 40,28 37.78,30.22 C200.+ 31.02,26.52 30,25.5 26.5,25.5 24.5,23.5 21.2,23.5 R103.2 R102.1 | C201.+ 42.57,14.94 41.5,16 41.5,17.7
  Top 1.829: 41.5,17.7 L2.1
  Bottom 0.254: IC3.4 36.19,28.18 v36,28
  Bottom 1.27: R200.2 v36,28
DB4
  Top 0.254: U$3.3 70.44,56.44 71,57 73.5,57 74.5,58 74.5,60 73.5,61 69.5,61 68,62.5 68,69.16 SV1.11
DB5
  Top 0.254: U$3.6 66.63,67.89 SV1.12
DB6
  Top 0.254: U$3.7 65.36,69.27 SV1.13
DB7
  Top 0.254: U$3.8 64.09,67.89 SV1.14
DISPLAYEN
  Top 0.254: U$3.15 66.63,34.38 68,33 68,15.5 74,9 80.79,9 Q5.G
E  (via drill 0.41 pad 0.3)
  Top 0.254: v63,56 63,45.05 U$3.9
  Bottom 0.254: SV1.6 74.3,66.8 73.5,66 64,66 62.5,64.5 62.5,56.5 v63,56
EN_3V3  (via drill 0.41)
  Top 0.254: v26.5,66 26.5,70.5 24,73 v22.5,73
  Bottom 0.254: IC1.12 25.6,61.6 26.5,62.5 v26.5,66 | 14,72.85 R24.1 v22.5,73
EN_CIRCUIT  (via drill 0.41)
  Top 0.254: v45,31 v45,33 | v37.5,50 37.5,50.5 38,51 38,52 39,53 39,58 32.5,64.5 v25,64.5
  Bottom 0.254: R22.1 37,21 45,29 v45,31 | v45,33 45,34 47.5,36.5 47.5,46.5 43.5,50.5 38,50.5 v37.5,50 | IC1.11 24.8,64.3 v25,64.5
FROM_CELL
  Top 1.778: U$13.P$1 5.15,29.86 3.5,31.5 R101.2 R100.1
  Bottom 0.406: IC2.4 5.15,30.44 U$13.P$1
FROM_CELL_CON
  Top 1.778: X1.L1 4.49,16.96 U$13.P$2
GND
  pour Top: 0,0 49.53,0 49.53,86.36 0,86.36
  pour Bottom: 0,4 49.53,4 49.53,86.36 0,86.36
GND_2  (via drill 0.41 pad 0.3)
  Top 0.254: C10.2 59.85,51.85 61,53 61.41,53 U$3.10 61.14,52.87 v60,54
  pour Bottom: 57,0 89,0 89,85 88,86 57,86
HO
  Bottom 0.406: R15.1 30.57,37.57 27.46,34.46 U$1.7
LED1  (via drill 0.41)
  Top 0.254: LED1.A 38.5,81 38,80.5 37.5,80.5 33.5,76.5 v24.5,76.5
  Bottom 0.254: IC1.32 21.21,51.21 20,50 13,50 11,52 11,62 13,64 13,67.5 15,69.5 24,69.5 24.5,70 v24.5,76.5
LED2  (via drill 0.41)
  Top 0.254: LED2.A v40.5,81
  Bottom 0.254: v40.5,81 40.5,80 40,79.5 35.5,79.5 32.5,76.5 27,76.5 26,75.5 26,69.5 25.5,69 15.5,69 13.5,67 13.5,63.5 11.5,61.5 11.5,52.5 13.5,50.5 19.5,50.5 IC1.1
LED3  (via drill 0.41)
  Top 0.254: LED3.A v42.5,81
  Bottom 0.254: v42.5,81 42.5,79.5 42,79 36,79 33,76 27.5,76 26.5,75 26.5,69 26,68.5 24,68.5 23,67.5 23,64.5 21.5,63 14,63 12,61 12,53 14,51 19,51 20,52 20,52.5 21,53.5 IC1.2
LED4  (via drill 0.41)
  Top 0.254: LED4.A v44.5,81
  Bottom 0.254: v44.5,81 44.5,79 44,78.5 36.5,78.5 33.5,75.5 28,75.5 27,74.5 27,68.5 26.5,68 24.5,68 23.5,67 23.5,61.5 23.2,61.2 IC1.9
LED5  (via drill 0.41)
  Top 0.254: LED5.A v46.5,81
  Bottom 0.254: v46.5,81 46.5,78.5 46,78 37,78 34,75 28.5,75 27.5,74 27.5,68 27,67.5 25,67.5 24,66.5 IC1.10
LO
  Bottom 0.406: U$1.5 25.5,37 23.5,35 23.5,33 22.5,32 22,32 21,31 R16.1
MISO
  Bottom 0.254: IC1.16 33.79,59.79 37,63 37,70 36.5,70.5 34.94,70.5 J1.1
MOSI
  Bottom 0.254: IC1.15 28,61 28.5,61.5 31,61.5 32,60.5 33,60.5 33.5,61 33.5,64 33,64.5 33,67.33 J1.4
MPPT_ENABLE  (via drill 0.41)
  Top 0.254: v15.5,45.5 15.5,48 17.5,50 25.5,50 27.5,52 27.5,57.5 27,58 v26,58
  Bottom 0.254: IC1.13 26.4,58.4 v26,58 | R12.1 15.5,37 15,37.5 15,45 v15.5,45.5
MPPT_PWM  (via drill 0.41)
  Top 0.254: v25.5,55 24.5,55 23.5,54 18,54 14.5,50.5 v14.5,46.5
  Bottom 0.254: IC1.14 27.2,56.7 v25.5,55 | R13.1 15,35 14.5,35.5 v14.5,46.5
N$1
  Bottom 0.254: IC1.20 32.55,55.9 C6.2
N$2
  Bottom 0.406: R4.3 44.65,66.04 R11.2
N$3
  Bottom 0.406: R7.3 44.07,55.88 R10.2
N$4
  Top 0.406: R7.1 46.2,50.8 46,51 R8.1
N$5
  Top 0.406: R9.1 45,62 46.04,60.96 R4.1
N$6  (via drill 0.41)
  Top 0.254: LED1.C v38.5,77
  Bottom 0.254: v38.5,77 R18.1
N$7  (via drill 0.41 pad 0.3)
  Top 0.254: v70,38.5 70,41 70.5,41.5 70.5,43.53 U$3.18
  Bottom 0.254: v70,38.5 68,38.5 67,37.5 63.5,37.5 59,33 59,28 59.5,27.5 59.97,27.5 JP1.1
N$8
  Bottom 0.406: R12.2 19,37 20.27,35.73 U$1.3
N$9  (via drill 0.41)
  Top 0.254: v32,41.5 30.5,41.5 28.5,39.5 v12,39.5
  Bottom 0.254: U$1.8 27.69,33.19 31.5,37 31.5,41 v32,41.5 | v12,39.5 12,43.5 10.16,45.34 D1.C
  Bottom 0.406: C7.1 25.85,32.96 U$1.8
N$10
  Bottom 0.406: U$1.2 18.99,34.46 R13.2
N$11
  Bottom 0.406: R16.2 16.65,28.43 Q4.G
N$12
  Bottom 0.254: D2.C 24.13,44.45 Q2.G 22.86,46.72 R14.1
N$13
  Bottom 0.406: R15.2 33.19,44.45 D2.A 36.48,46 44,46 45.09,44.91 Q3.G
N$14
  Top 1.778: Q2.D 20.32,45.32 22,47 41,47 42.55,45.45 Q3.D
N$15
  Top 0.254: R17.S 75.99,32.1 R21.1
N$16
  Top 1.778: X3.L2 41.24,11.77 34.59,18.41 Q8.D
  Bottom 1.778: D4.1 41.3,7.24 X3.L2
N$17
  Bottom 1.27: C202.1 R200.1
N$18  (via drill 0.41)
  Top 0.254: LED2.C v40.5,77
  Bottom 0.254: v40.5,77 R25.1
N$19
  Top 0.254: JP2.2 66.22,9.32 R5.1 66.25,24.25 67,25 67,31 61.55,36.45 U$3.11
N$20
  Bottom 0.406: Q8.G 34.78,15.88 Q6.3 34.9,18.95 R19.2
N$21
  Bottom 0.406: Q6.1 37.1,19.05 R22.2
N$22
  Bottom 0.406: Q7.G 3.81,69.86 R23.2 5.9,70 Q9.3
N$23
  Bottom 0.406: Q9.1 12.1,72.95 R24.2
N$24
  Top 0.254: R21.2 75.35,36.35 77,38 77,47.5 77.5,48 79.22,48 J4.2
N$25
  Top 0.305: Q7.D 6.35,77.32 X4.L2
  Bottom 0.305: X4.L2 4.49,76.67 D5.1
N$26  (via drill 0.41)
  Top 0.254: LED3.C v42.5,77
  Bottom 0.254: v42.5,77 R26.1
N$27  (via drill 0.41 pad 0.3)
  Top 0.254: U$3.1 74.93,52.87 R2.1 75,52.9 v75,55
  Bottom 0.254: JP1.5 69.23,27.23 71.5,29.5 71.5,36 72.5,37 72.5,39.5 72,40 64.5,40 64,40.5 64,48 71,55 v75,55
N$28
  Top 0.254: R17.E 81.26,42.26 84,45 84.53,45 Q10.S
N$29  (via drill 0.41)
  Top 0.254: LED4.C v44.5,77
  Bottom 0.254: v44.5,77 R27.1
N$30
  Top 0.254: U$3.4 69.17,57.16 70.5,58.5 72.85,58.5 Y1.2
  Bottom 0.254: Y1.2 73.66,58.66 74.5,59.5 74.5,61.23 C11.2
N$31
  Top 0.254: U$3.5 67.9,58.62 Y1.1
  Bottom 0.254: Y1.1 67.93,60.78 C12.2
N$32  (via drill 0.41)
  Top 0.254: LED5.C v46.5,77
  Bottom 0.254: v46.5,77 R28.1
N$33
  Top 0.254: C3.+ 84.58,14.73 IC6.1 85.5,14.83 Q5.S
OW
  Top 0.254: U$3.2 71.71,55.7 72,56 73.5,56 75,57.5 75,60.5 74,61.5 70,61.5 69,62.5 69,64.5 70.5,66 70.5,74 69.25,75.25 | 69.25,75.25 68,76.5 67,76.5 66.5,77 66.5,79.01 X6.L2 | IC5.2 83.99,77.99 82,76 70,76 69.25,75.25
R/W  (via drill 0.41 pad 0.3)
  Top 0.254: v63,40.5 63,43.41 U$3.12
  Bottom 0.254: SV1.5 74.3,71.7 74,72 63,72 62,71 62,41.5 v63,40.5
RESET  (via drill 0.41)
  Top 0.254: v27,61.5 25,59.5 25,57 25.5,56.5 26.5,56.5 27,56 27,53.5 26.5,53 v25,53
  Bottom 0.254: IC1.29 25.6,52.4 v25,53 | v27,61.5 27.5,62 27.5,63.5 28,64 | 28,64 28,69 29,70 29.36,70 J1.5 | R1.1 28.59,63.41 28,64
RS  (via drill 0.41 pad 0.3)
  Top 0.254: v65,41 64,42 64,43.51 U$3.13
  Bottom 0.254: SV1.4 76.84,58.16 82,53 82,50.88 R20.S 77.8,50.8 76,49 76,44 73,41 v65,41
SCK
  Bottom 0.254: IC1.17 33.3,58.3 37.5,62.5 37.5,70.5 36.5,71.5 36.5,73.5 36,74 33,74 32.5,73.5 32.5,70.6 J1.3
SCL  (via drill 0.41 pad 0.3)
  Top 0.254: J3.5 3.81,50.16 4.45,49.53 10.16,49.53 v10.8,50.16
  Bottom 0.254: IC1.28 26.4,49.9 26,49.5 11.46,49.5 v10.8,50.16 10.48,50.48 10.48,50.8 10.5,50.82 10.5,62.5 12.5,64.5 12.5,68 14.5,70 23.5,70 24,70.5 24,75.5 23.5,76 23.5,77.5 24,78 26,78 26.5,78.5 26.5,79.02 X5.L2
SCL2  (via drill 0.41 pad 0.3)
  Top 0.254: v71.5,38 71.5,43.39 U$3.19
  Bottom 0.254: v71.5,38 70.5,37 70.5,29.5 69.5,28.5 64,28.5 62.78,27.28 JP1.3 62.5,26.95 62.5,26 62,25.5 59.5,25.5 59,25 59,15 60.06,13.94 J2.5
SDA  (via drill 0.41 pad 0.3)
  Top 0.254: J3.4 v8.12,53.34
  Bottom 0.254: IC1.27 27.2,49.7 26.5,49 10.1,49 9.37,49.73 9.37,50.64 9.84,51.12 9.84,52.7 | 9.84,52.7 9.84,62.87 12,65 12,68.5 14,70.5 23,70.5 23.5,71 23.5,75 22,76.5 22,78.86 X5.L3 | v8.12,53.34 9.21,53.34 9.84,52.7
SDA2  (via drill 0.41 pad 0.3)
  Top 0.254: U$3.17 69.22,40.64 68.67,40.09 68.67,37.66 v68,37 | J2.4 60.52,16.48 59,18 59,31 59.5,31.5 61.05,31.5 JP1.4
  Bottom 0.254: v68,37 64,37 63,36 63,29.99 JP1.4
VS  (via drill 0.41 pad 0.3)
  Top 1.778: v40,37 41,36 L2.2 L1.1 22.15,33.65 20.32,31.82 Q4.D | Q3.S v40,41 39.73,41.27 D3.C
  Top 1.829: Q3.S
  Bottom 0.406: Q4.D 20.32,29.32 22,31 C7.2 24.15,34.65 25.23,35.73 U$1.6
  Bottom 1.27: C202.2 26,28 25.5,27.5 25.5,24.5 25,24 21,24 20.5,24.5 20.5,27.12 Q4.D
  Bottom 1.778: v40,37 v40,41
XTAL1
  Bottom 0.254: C1.2 18,53.5 19,54.5 19,55.6 Q1.3 20.4,57 20.5,57 21,57.5 IC1.7
XTAL2
  Bottom 0.254: IC1.8 20,60 17.9,60 C2.2 17.1,60.5 Q1.1

### Text on the board
Bottom: MoarChargezzzzzz Rev. A
tPlace: 3.3V↑ / 0.8A MAX | CELL↑ | BAT↑ | LOAD↑
Document: Note: Trace Width for High Power Tracks (10A) is 72 mil for 70µm copper with 30°C temp rise at ambient 25°C. / / This is enough to cover an ambient temperature up to 60°C. / / Note that if you etch this board on 35µm copper you're limited to about 6A. / / Silkscreen is not adjusted yet due to prototype status. Check back later :-)